# Altium schematic sheet NODE_MCU_EXTEND_Project.SchDoc
size A4
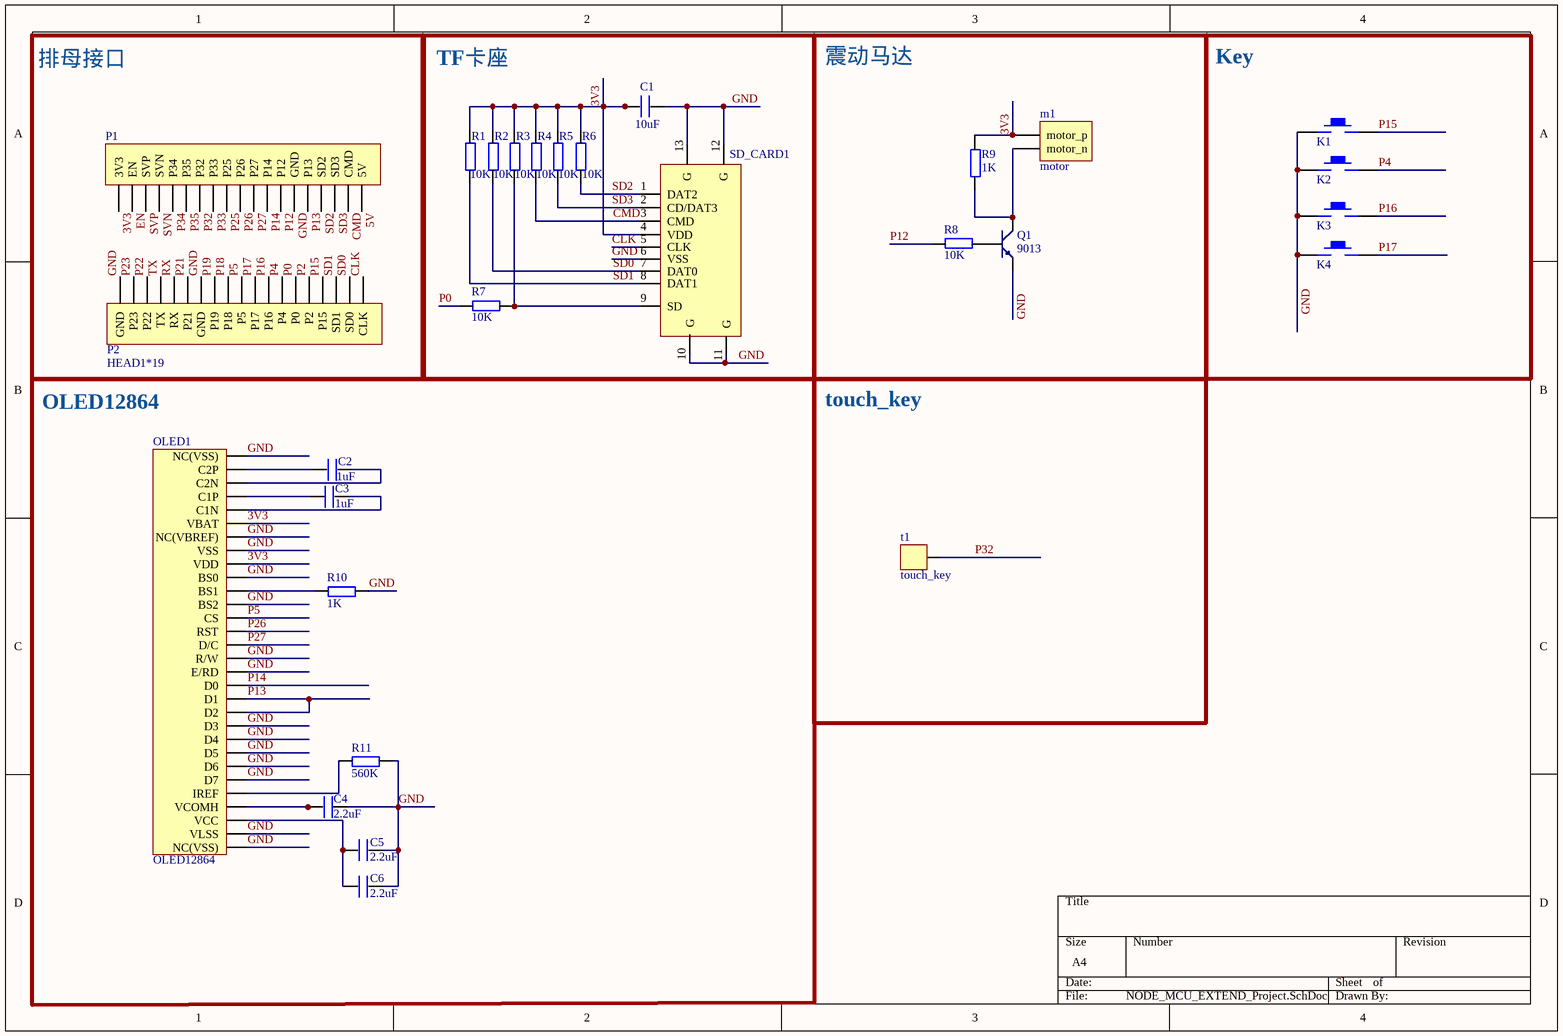
[diagram p0: NODE_MCU_EXTEND_Project.SchDoc]

## Parts
C1  10uF  [0603P - duplicate]
C2  1uF  [0603P - duplicate]
C3  1uF  [0603P - duplicate]
C4  2.2uF  [0603P - duplicate]
C5  2.2uF  [0603P - duplicate]
C6  2.2uF  [0603P - duplicate]
K1  KEY_M  [KEY]  (value not drawn)
K2  KEY_M  [KEY]  (value not drawn)
K3  KEY_M  [KEY]  (value not drawn)
K4  KEY_M  [KEY]  (value not drawn)
m1  motor  [motor]
OLED1  OLED12864  [OLED_1.3]
P1  (no value)  [HDR1X19]
P2  HEAD1*19  [HDR1X19]
Q1  9013  [SOT23-JL]
R1  10K  [0603P - duplicate]
R2  10K  [0603P - duplicate]
R3  10K  [0603P - duplicate]
R4  10K  [0603P - duplicate]
R5  10K  [0603P - duplicate]
R6  10K  [0603P - duplicate]
R7  10K  [0603P - duplicate]
R8  10K  [0603P - duplicate]
R9  1K  [0603P - duplicate]
R10  1K  [0603P - duplicate]
R11  560K  [0603P - duplicate]
SD_CARD1  (no value)  [CON-TFCARD/AUTO-EJECT]
t1  touch_key  [touch_key]

## Blocks framed on the sheet
排母接口: P1 P2
TF卡座: C1 R1-R7 SD_CARD1
震动马达: m1 Q1 R8 R9
Key: K1-K4
OLED12864: C2-C6 OLED1 R10 R11
touch_key: t1

## Nets
3V3: C1.1 m1.1(motor_p) OLED1.6(VBAT) OLED1.9(VDD) P1.1(3V3) R1.2 R2.2 R3.2 R4.2 R5.2 R6.2 R9.2 SD_CARD1.4(VDD)
5V: P1.19(5V)
CLK: P2.19(CLK) SD_CARD1.5(CLK)
CMD: P1.18(CMD) R4.1 SD_CARD1.3(CMD)
EN: P1.2(EN)
GND: C1.2 C4.2 C5.2 C6.2 K1.1 K2.1 K3.1 K4.1 OLED1.1(NC(VSS)) OLED1.7(NC(VBREF)) OLED1.8(VSS) OLED1.10(BS0) OLED1.12(BS2) OLED1.16(R/W) OLED1.17(E/RD) OLED1.21(D3) OLED1.22(D4) OLED1.23(D5) OLED1.24(D6) OLED1.25(D7) OLED1.29(VLSS) OLED1.30(NC(VSS)) P1.14(GND) P2.1(GND) P2.7(GND) Q1.2(E) R10.2 R11.2 SD_CARD1.6(VSS) SD_CARD1.10(G) SD_CARD1.11(G) SD_CARD1.12(G) SD_CARD1.13(G)
P0: P2.14(P0) R7.2
P2: P2.15(P2)
P4: K2.2 P2.13(P4)
P5: OLED1.13(CS) P2.10(P5)
P12: P1.13(P12) R8.2
P13: OLED1.19(D1) OLED1.20(D2) P1.15(P13)
P14: OLED1.18(D0) P1.12(P14)
P15: K1.2 P2.16(P15)
P16: K3.2 P2.12(P16)
P17: K4.2 P2.11(P17)
P18: P2.9(P18)
P19: P2.8(P19)
P21: P2.6(P21)
P22: P2.3(P22)
P23: P2.2(P23)
P25: P1.9(P25)
P26: OLED1.14(RST) P1.10(P26)
P27: OLED1.15(D/C) P1.11(P27)
P32: P1.7(P32) t1.1
P33: P1.8(P33)
P34: P1.5(P34)
P35: P1.6(P35)
RX: P2.5(RX)
SD0: P2.18(SD0) R2.1 SD_CARD1.7(DAT0)
SD1: P2.17(SD1) R1.1 SD_CARD1.8(DAT1)
SD2: P1.16(SD2) R6.1 SD_CARD1.1(DAT2)
SD3: P1.17(SD3) R5.1 SD_CARD1.2(CD/DAT3)
SVN: P1.4(SVN)
SVP: P1.3(SVP)
TX: P2.4(TX)
NetC2_1: C2.1 OLED1.2(C2P)
NetC2_2: C2.2 OLED1.3(C2N)
NetC3_1: C3.1 OLED1.4(C1P)
NetC3_2: C3.2 OLED1.5(C1N)
NetC4_1: C4.1 OLED1.27(VCOMH)
NetC5_1: C5.1 C6.1 OLED1.28(VCC)
Netm1_2: m1.2(motor_n) Q1.3(C) R9.1
NetOLED1_11: OLED1.11(BS1) R10.1
NetOLED1_26: OLED1.26(IREF) R11.1
NetQ1_1: Q1.1(B) R8.1
NetR3_1: R3.1 R7.1 SD_CARD1.9(SD)

## Library data of the parts
C1-C6 = C
P1 = Header 19 Up: Header, 16-Pin; LatestRevisionDate: 17-Jul-2002; LatestRevisionNote: Re-released for DXP Platform.; Publisher: Altium Limited
P2 = Header 19 Down: LatestRevisionDate: 17-Jul-2002; LatestRevisionNote: Re-released for DXP Platform.; Publisher: Altium Limited
Q1 = NPN
R1-R11 = R
SD_CARD1 = sd card
m1 = motor: LatestRevisionDate: 17-Jul-2002; LatestRevisionNote: Re-released for DXP Platform.; Publisher: Altium Limited